# Altium schematic sheet Gyrophare-CarteDeCommande.SchDoc
size A4
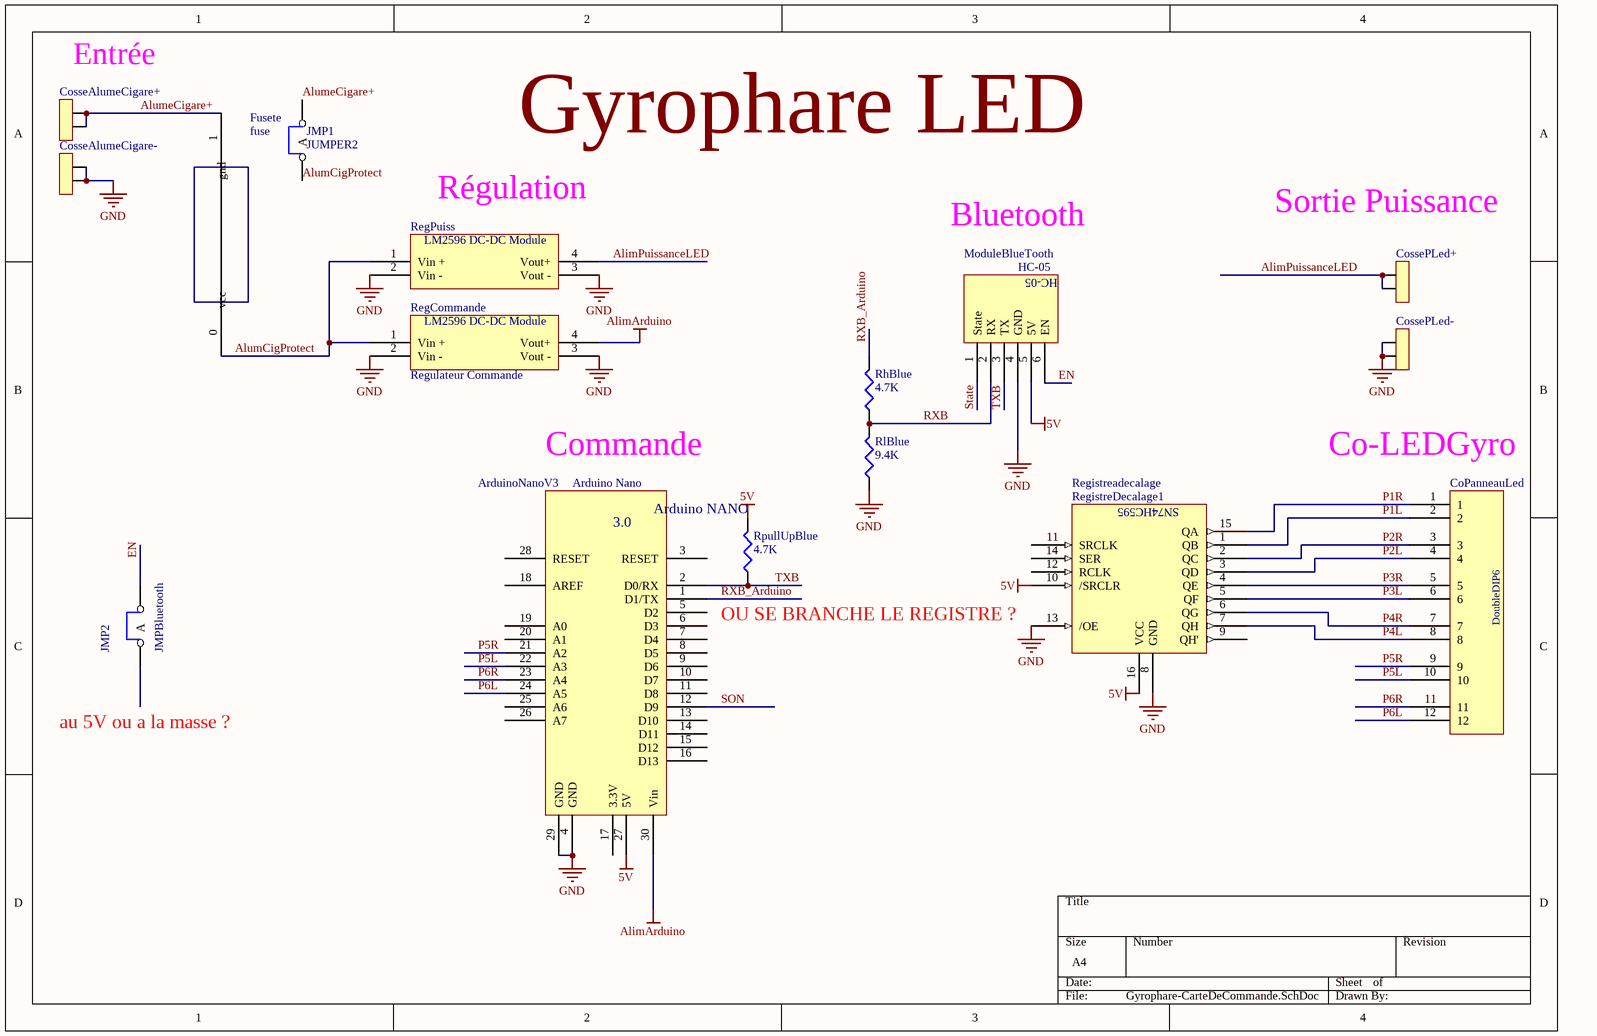
[diagram p0: Gyrophare-CarteDeCommande.SchDoc]

## Parts
ArduinoNanoV3  Arduino Nano  [Arduino Nano FootPrint]
CoPanneauLed  Co-DoubleDip6  [DoubleDIP6]  (value not drawn)
CosseAlumeCigare+  CosseAlumeCigare+  [POWER2]  (value not drawn)
CosseAlumeCigare-  CosseAlumeCigare+  [POWER2]  (value not drawn)
CossePLed+  comment  [POWER2]  (value not drawn)
CossePLed-  comment  [POWER2]  (value not drawn)
Fusete  fuse  [FUSE]
JMP1  JUMPER2  [JMP2-100]
JMPBluetooth  JMP2  [JMP2-100]
ModuleBlueTooth  HC-05  [HC-05 Couché]
RegCommande  Regulateur Commande  [Module LM2596 DC-DC]
RegistreDecalage1  Registreadecalage  [74HC595]
RegPuiss  Regulateur Puissant  [Module LM2596 DC-DC]  (value not drawn)
RhBlue  value 4.7K  [0805]  (hidden comment: RES)
RlBlue  value 9.4K  [0805]  (hidden comment: RES)
RpullUpBlue  value 4.7K  [0805]  (hidden comment: RES)

## Nets
5V: ArduinoNanoV3.27(5V) ModuleBlueTooth.5(5V) RegistreDecalage1.10(/SRCLR) RegistreDecalage1.16(VCC) RpullUpBlue.2
AlimArduino: ArduinoNanoV3.30(Vin) RegCommande.4(Vout+)
GND: ArduinoNanoV3.4(GND) ArduinoNanoV3.29(GND) CosseAlumeCigare-.1 CosseAlumeCigare-.2 CossePLed-.1 CossePLed-.2 ModuleBlueTooth.4(GND) RegCommande.2(Vin_-) RegCommande.3(Vout_-) RegistreDecalage1.8(GND) RegistreDecalage1.13(/OE) RegPuiss.2(Vin_-) RegPuiss.3(Vout_-) RlBlue.1
AlimPuissanceLED: CossePLed+.1 CossePLed+.2 RegPuiss.4(Vout+)
AlumCigProtect: Fusete.0(vcc) JMP1.1(A) RegCommande.1(Vin_+) RegPuiss.1(Vin_+)
AlumeCigare+: CosseAlumeCigare+.1 CosseAlumeCigare+.2 Fusete.1(gnd) JMP1.2(com)
EN: JMPBluetooth.2(com) ModuleBlueTooth.6(EN)
P1L: CoPanneauLed.2 RegistreDecalage1.1(QB)
P1R: CoPanneauLed.1 RegistreDecalage1.15(QA)
P2L: CoPanneauLed.4 RegistreDecalage1.3(QD)
P2R: CoPanneauLed.3 RegistreDecalage1.2(QC)
P3L: CoPanneauLed.6 RegistreDecalage1.5(QF)
P3R: CoPanneauLed.5 RegistreDecalage1.4(QE)
P4L: CoPanneauLed.8 RegistreDecalage1.7(QH)
P4R: CoPanneauLed.7 RegistreDecalage1.6(QG)
P5L: ArduinoNanoV3.22(A3) CoPanneauLed.10
P5R: ArduinoNanoV3.21(A2) CoPanneauLed.9
P6L: ArduinoNanoV3.24(A5) CoPanneauLed.12
P6R: ArduinoNanoV3.23(A4) CoPanneauLed.11
RXB: ModuleBlueTooth.2(RX) RhBlue.1 RlBlue.2
RXB_Arduino: ArduinoNanoV3.1(D1/TX) RhBlue.2
SON: ArduinoNanoV3.12(D9)
State: ModuleBlueTooth.1(State)
TXB: ArduinoNanoV3.2(D0/RX) ModuleBlueTooth.3(TX) RpullUpBlue.1

Not connected (* = marked no-connect by the designer): ArduinoNanoV3 3(RESET) 5(D2) 6(D3) 7(D4) 8(D5) 9(D6) 10(D7) 11(D8) 13(D10) 14(D11) 15(D12) 16(D13) 17(3.3V) 18(AREF) 19(A0) 20(A1) 25(A6) 26(A7) 28(RESET); JMPBluetooth 1(A); RegistreDecalage1 9(QH') 11(SRCLK) 12(RCLK) 14(SER)

## Notes on the sheet
- (near CosseAlumeCigare+) Entrée
- Gyrophare LED
- Régulation
- Bluetooth
- Sortie Puissance
- Commande
- (near CoPanneauLed) Co-LEDGyro
- (near RpullUpBlue) OU SE BRANCHE LE REGISTRE ?
- au 5V ou a la masse ?
- (in symbol 74HC595) SN74HC595
- (in symbol Arduino Nano) Arduino NANO; 3.0
- (in symbol Co-DoubleDip6) DoubleDIP6
- (in symbol Component_1) LM2596 DC-DC Module

## Library data of the parts
CosseAlumeCigare+ CosseAlumeCigare- CossePLed+ CossePLed- = POWER2: connecteur alim 2 pôles
JMP1 JMPBluetooth = JUMPER2: cavalier 1 position
RegCommande RegPuiss = Component_1
RegistreDecalage1 = 74HC595
RhBlue RlBlue RpullUpBlue = RES: resistance